# Altium schematic sheet P_Power.schdoc
size 406 x 228 mm; DocumentNumber: 2; SheetNumber: 2; SheetTotal: 5
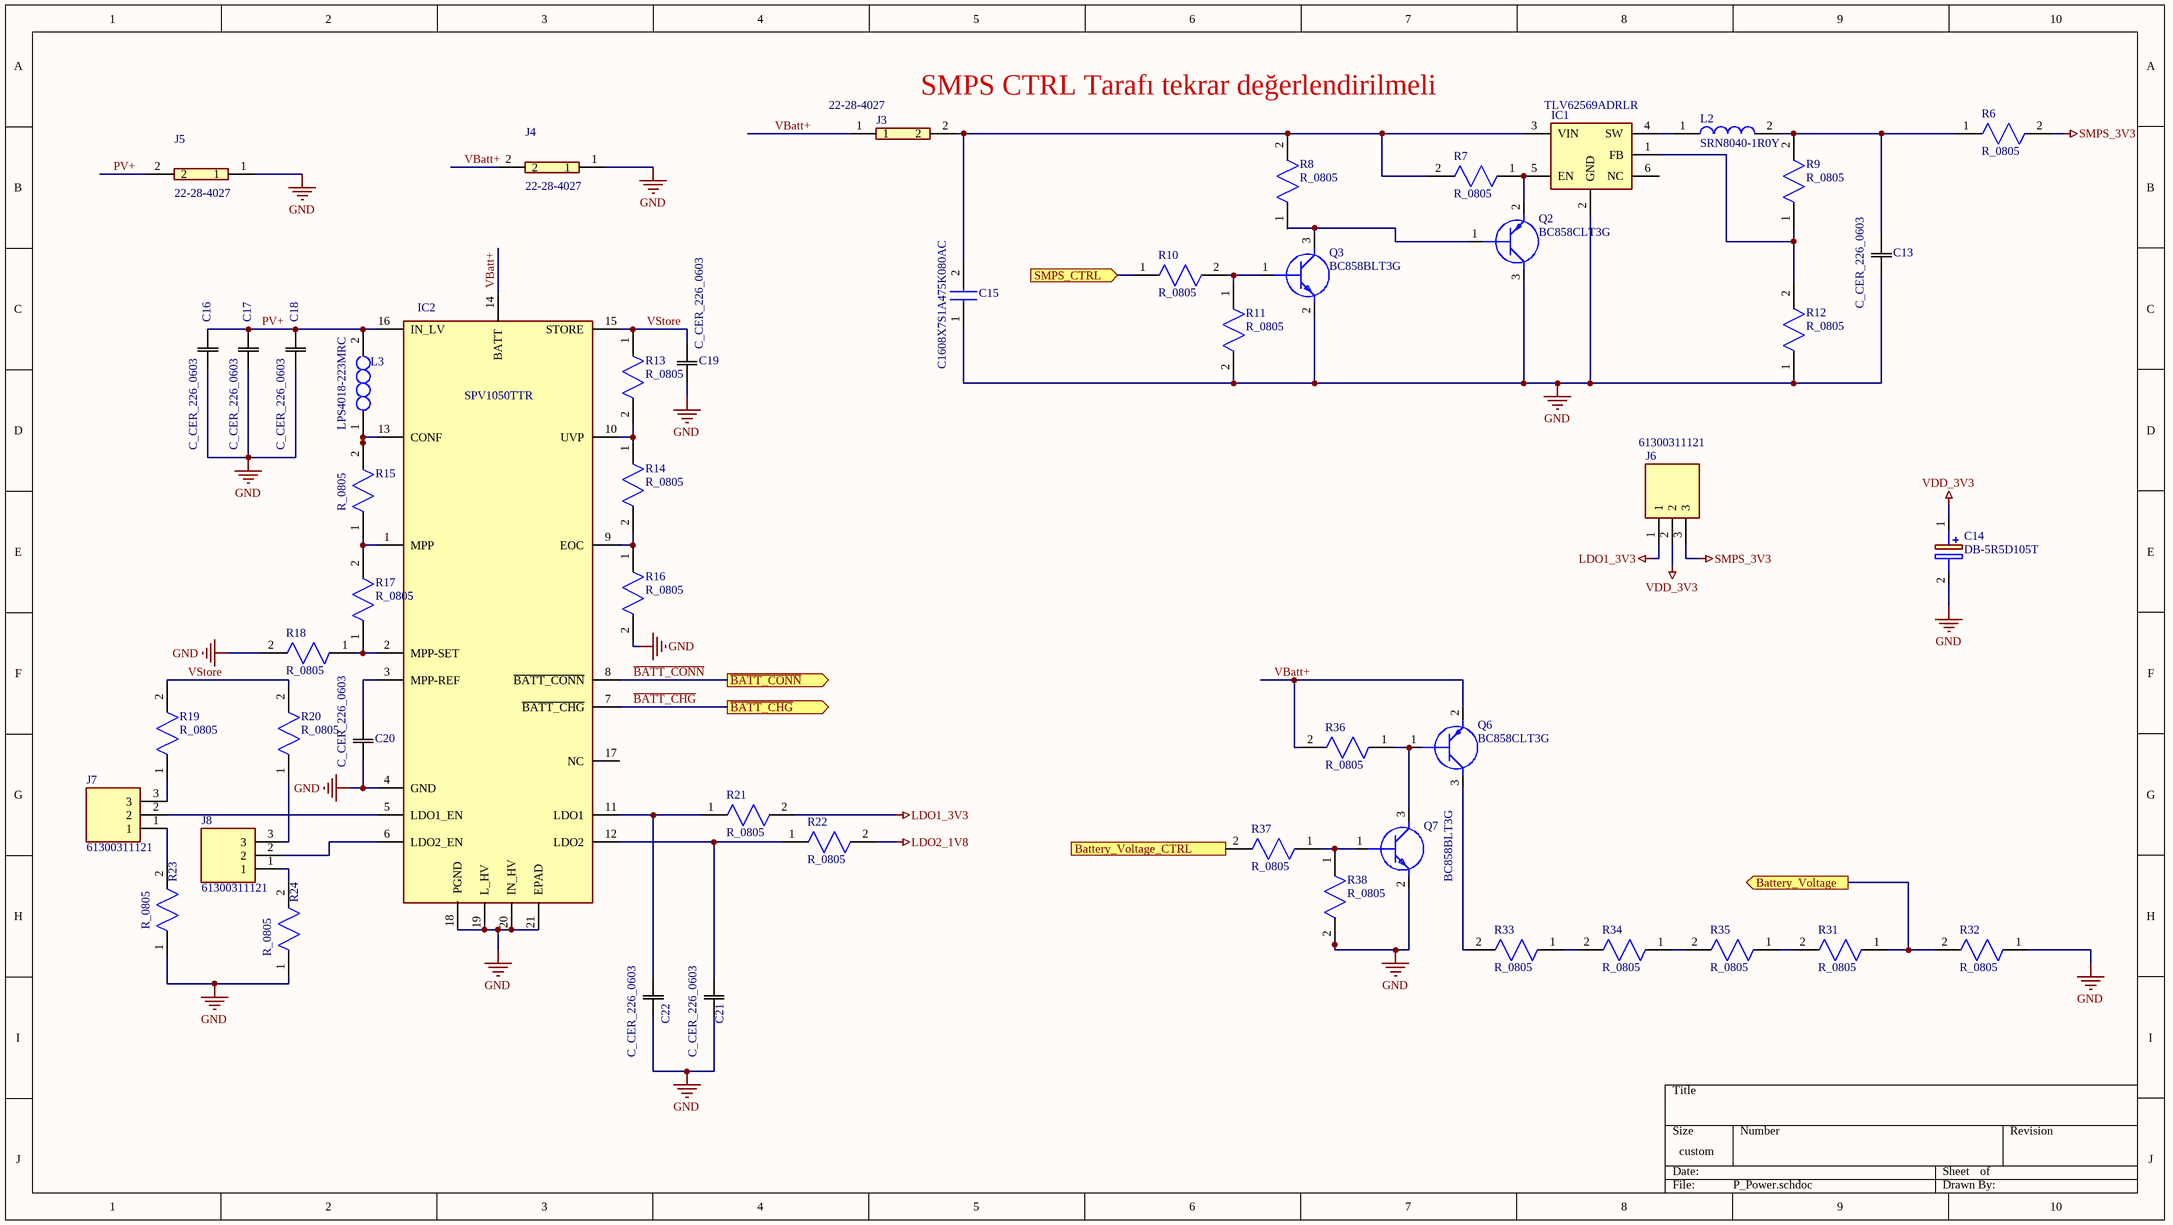
[diagram p0: P_Power.schdoc]

## Parts
C13  C_CER_226_0603  [CAPC1608X90N]
C14  DB-5R5D105T  [CAPPRD500W130D2150H800]
C15  C1608X7S1A475K080AC  [CAPC1608X90N]
C16  C_CER_226_0603  [CAPC1608X90N]
C17  C_CER_226_0603  [CAPC1608X90N]
C18  C_CER_226_0603  [CAPC1608X90N]
C19  C_CER_226_0603  [CAPC1608X90N]
C20  C_CER_226_0603  [CAPC1608X90N]
C21  C_CER_226_0603  [CAPC1608X90N]
C22  C_CER_226_0603  [CAPC1608X90N]
IC1  TLV62569ADRLR  [SOTFL50P160X60-6N]
IC2  SPV1050TTR  [QFN40P300X300X100-21N-D]
J3  22-28-4027  [HDRV2W66P0X254_1X2_508X249X1067P]
J4  22-28-4027  [HDRV2W66P0X254_1X2_508X249X1067P]
J5  22-28-4027  [HDRV2W66P0X254_1X2_508X249X1067P]
J6  61300311121  [HDRV3W95P0X254_1X3_762X254X869P]
J7  61300311121  [HDRV3W95P0X254_1X3_762X254X869P]
J8  61300311121  [HDRV3W95P0X254_1X3_762X254X869P]
L2  SRN8040-1R0Y  [SRN80408R2Y]
L3  LPS4018-223MRC  [LPS4018223MRC]
Q2  BC858CLT3G  [BC858CLT3G]
Q3  BC858BLT3G  [SOT96P237X111-3N]
Q6  BC858CLT3G  [BC858CLT3G]
Q7  BC858BLT3G  [SOT96P237X111-3N]
R6  R_0805  [RESC2012X55N]
R7  R_0805  [RESC2012X55N]
R8  R_0805  [RESC2012X55N]
R9  R_0805  [RESC2012X55N]
R10  R_0805  [RESC2012X55N]
R11  R_0805  [RESC2012X55N]
R12  R_0805  [RESC2012X55N]
R13  R_0805  [RESC2012X55N]
R14  R_0805  [RESC2012X55N]
R15  R_0805  [RESC2012X55N]
R16  R_0805  [RESC2012X55N]
R17  R_0805  [RESC2012X55N]
R18  R_0805  [RESC2012X55N]
R19  R_0805  [RESC2012X55N]
R20  R_0805  [RESC2012X55N]
R21  R_0805  [RESC2012X55N]
R22  R_0805  [RESC2012X55N]
R23  R_0805  [RESC2012X55N]
R24  R_0805  [RESC2012X55N]
R31  R_0805  [RESC2012X55N]
R32  R_0805  [RESC2012X55N]
R33  R_0805  [RESC2012X55N]
R34  R_0805  [RESC2012X55N]
R35  R_0805  [RESC2012X55N]
R36  R_0805  [RESC2012X55N]
R37  R_0805  [RESC2012X55N]
R38  R_0805  [RESC2012X55N]

## Ports
Battery_Voltage (out), Battery_Voltage_CTRL (in), SMPS_CTRL (in), ~{BATT_CHG} (out), ~{BATT_CONN} (out)

## Nets
GND: C13.1 C14.2(-) C15.1 C16.1 C17.1 C18.1 C19.1 C20.1 C21.1 C22.1 IC1.2(GND) IC2.4(GND) IC2.18(PGND) IC2.19(L_HV) IC2.20(IN_HV) IC2.21(EPAD) J4.1 J5.1 Q2.3(C) Q3.2(E) Q7.2(E) R11.2 R12.1 R16.2 R18.2 R23.1 R24.1 R32.1 R38.2
LDO1_3V3: J6.1 R21.2
LDO2_1V8: R22.2
SMPS_3V3: J6.3 R6.2
VDD_3V3: C14.1(+) J6.2
~{BATT_CHG}: IC2.7(~{BATT_CHG}) ; port ~{BATT_CHG}
~{BATT_CONN}: IC2.8(~{BATT_CONN}) ; port ~{BATT_CONN}
Battery_Voltage: R31.1 R32.2 ; port Battery_Voltage
Battery_Voltage_CTRL: R37.2 ; port Battery_Voltage_CTRL
PV+: C16.2 C17.2 C18.2 IC2.16(IN_LV) J5.2 L3.2
SMPS_CTRL: R10.1 ; port SMPS_CTRL
VBatt+: IC2.14(BATT) J3.1 J4.2 Q6.2(E) R36.2
VStore: C19.2 IC2.15(STORE) R13.1 R19.2 R20.2
NetC13_2: C13.2 L2.2 R6.1 R9.2
NetC15_2: C15.2 IC1.3(VIN) J3.2 R7.2 R8.2
NetC20_2: C20.2 IC2.3(MPP-REF)
NetC21_2: C21.2 IC2.12(LDO2) R22.1
NetC22_2: C22.2 IC2.11(LDO1) R21.1
NetIC1_1: IC1.1(FB) R9.1 R12.2
NetIC1_4: IC1.4(SW) L2.1
NetIC1_5: IC1.5(EN) Q2.2(E) R7.1
NetIC2_1: IC2.1(MPP) R15.1 R17.2
NetIC2_2: IC2.2(MPP-SET) R17.1 R18.1
NetIC2_5: IC2.5(LDO1_EN) J7.2
NetIC2_6: IC2.6(LDO2_EN) J8.2
NetIC2_9: IC2.9(EOC) R14.2 R16.1
NetIC2_10: IC2.10(UVP) R13.2 R14.1
NetIC2_13: IC2.13(CONF) L3.1 R15.2
NetJ7_1: J7.1 R23.2
NetJ7_3: J7.3 R19.1
NetJ8_1: J8.1 R24.2
NetJ8_3: J8.3 R20.1
NetQ2_1: Q2.1(B) Q3.3(C) R8.1
NetQ3_1: Q3.1(B) R10.2 R11.1
NetQ6_1: Q6.1(B) Q7.3(C) R36.1
NetQ6_3: Q6.3(C) R33.2
NetQ7_1: Q7.1(B) R37.1 R38.1
NetR31_2: R31.2 R35.1
NetR33_1: R33.1 R34.2
NetR34_1: R34.1 R35.2

Not connected (* = marked no-connect by the designer): IC1 6(NC); IC2 17(NC)

## Notes on the sheet
- SMPS CTRL Tarafı tekrar değerlendirilmeli

## Library data of the parts
C13 C16-C22 = C_CER_226_0603: Manufacturer_Part_Number: GRM188R60J226MEA0D; Vendor: Murata; SourceLibrary: Murata_2014-12-31; Type: DEV; Copyright: Copyright (C) 2015 Accelerated Designs. All rights reserved; RefDes: RefDes
C14 = DB-5R5D105T: Capacitor Polarised; Manufacturer_Name: Elna; Datasheet Link: https://componentsearchengine.com//DB-5R5D105T.pdf; Height: 8mm; Mouser2 Part Number: 555-DB-5R5D105T; Mouser2 Price/Stock: https://www.mouser.com/Search/Refine.aspx?Keyword=555-DB-5R5D105T; Manufacturer_Part_Number: DB-5R5D105T
C15 = C1608X7S1A475K080AC: Capacitor; Manufacturer_Name: TDK; Datasheet Link: https://product.tdk.com/info/en/catalog/datasheets/mlcc_commercial_midvoltage_en.pdf; Height: 0.9mm; Manufacturer_Part_Number: C1608X7S1A475K080AC
IC1 = TLV62569ADRLR: Integrated Circuit; Manufacturer_Name: Texas Instruments; Datasheet Link: http://www.ti.com/lit/gpn/tlv62569a; Height: 0.6mm; Manufacturer_Part_Number: TLV62569ADRLR
IC2 = SPV1050TTR: Integrated Circuit; Manufacturer_Name: STMicroelectronics; Datasheet Link: https://componentsearchengine.com//SPV1050TTR.pdf; Height: 1mm; Mouser2 Part Number: 511-SPV1050TTR; Mouser2 Price/Stock: https://www.mouser.com/Search/Refine.aspx?Keyword=511-SPV1050TTR; Manufacturer_Part_Number: SPV1050TTR
J3-J5 = 22-28-4027: Connector; Manufacturer_Name: Molex; Datasheet Link: https://componentsearchengine.com//22-28-4027.pdf; Height: 10.67mm; Mouser2 Part Number: 538-22-28-4027; Mouser2 Price/Stock: https://www.mouser.com/Search/Refine.aspx?Keyword=538-22-28-4027; Manufacturer_Part_Number: 22-28-4027
J6-J8 = 61300311121: Connector; Manufacturer_Name: Wurth Elektronik; Datasheet Link: https://componentsearchengine.com//61300311121.pdf; Height: 8.69mm; Mouser2 Part Number: 710-61300311121; Mouser2 Price/Stock: https://www.mouser.com/Search/Refine.aspx?Keyword=710-61300311121; Manufacturer_Part_Number: 61300311121
L2 = SRN8040-1R0Y: Inductor; Manufacturer_Name: Bourns; Datasheet Link: https://www.bourns.com/pdfs/SRN8040.pdf; Height: 4mm; Manufacturer_Part_Number: SRN8040-1R0Y
L3 = LPS4018-223MRC: Inductor; Manufacturer_Name: COILCRAFT; Datasheet Link: https://componentsearchengine.com//LPS4018-223MRC.pdf; Height: 1.8mm; Mouser2 Part Number: 994-LPS4018-223MRC; Mouser2 Price/Stock: https://www.mouser.com/Search/Refine.aspx?Keyword=994-LPS4018-223MRC; Manufacturer_Part_Number: LPS4018-223MRC
Q2 Q6 = BC858CLT3G: Transistor BJT PNP; Manufacturer_Name: ON Semiconductor; Datasheet Link: https://componentsearchengine.com//BC858CLT3G.pdf; Mouser2 Part Number: 863-BC858CLT3G; Mouser2 Price/Stock: https://www.mouser.com/Search/Refine.aspx?Keyword=863-BC858CLT3G; Manufacturer_Part_Number: BC858CLT3G
Q3 Q7 = BC858BLT3G: Transistor BJT PNP; Manufacturer_Name: ON Semiconductor; Datasheet Link: https://www.onsemi.com/pub/Collateral/BC856ALT1-D.PDF; Height: 1.11mm; Manufacturer_Part_Number: BC858BLT3G
R6-R24 R31-R38 = R_0805: Resistor; Manufacturer_Name: Vishay; Datasheet Link: http://www.vishay.com/docs/20035/dcrcwe3.pdf; Height: 0.4mm